# EAGLE schematic oshpark (EAGLE 6.6.0)
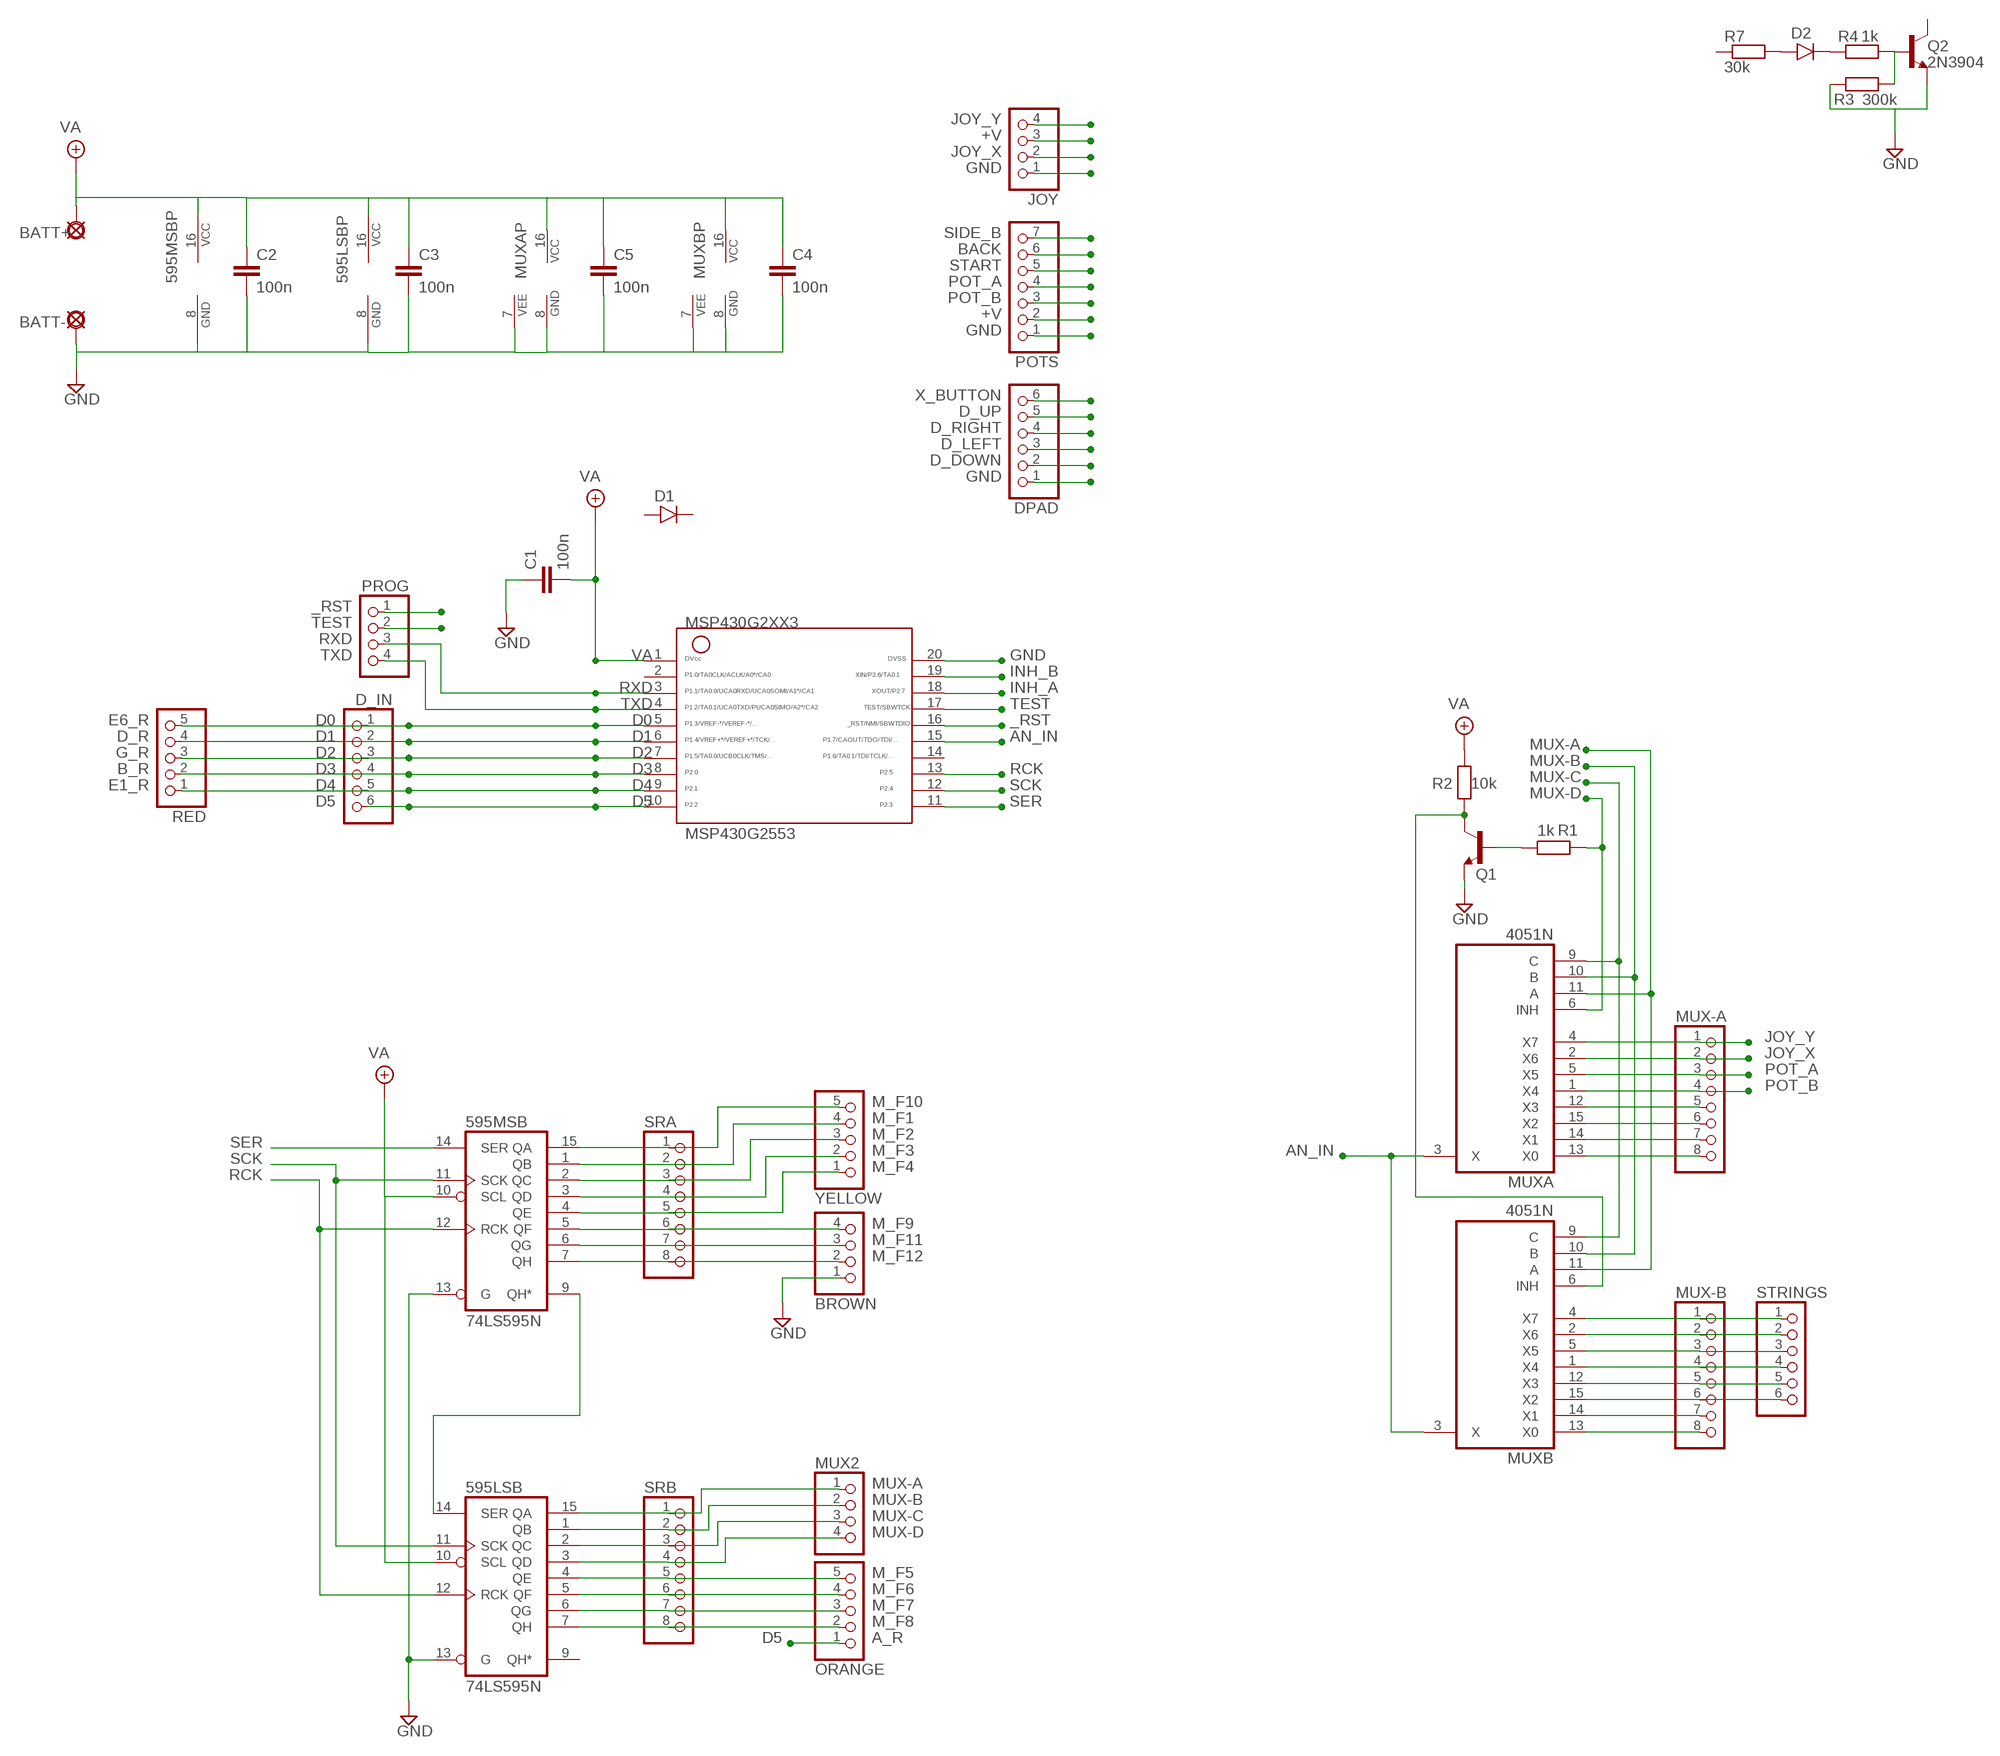
[diagram p0: schematic, sheet 1]

## Parts
595LSB  74LS595N  [DIL16]
595MSB  74LS595N  [DIL16]
BATT+  PADL  [LONG]
BATT-  PADL  [LONG]
BROWN  PINHD-1X4  [1X04]
C1  100n  050X030_050  [050X030_050_3]
C2  100n  050X030_050  [050X030_050_3]
C3  100n  050X030_050  [050X030_050_3]
C4  100n  050X030_050  [050X030_050_3]
C5  100n  050X030_050  [050X030_050_3]
D1  1N400X.4  [DO41-4]
D2  1N4148-2  [DO35-2]
D_IN  PINHD-1X6  [1X06]
DPAD  PINHD-1X6  [1X06]
JOY  PINHD-1X4  [1X04]
MSP430G2553  G2XX3---N20  [N20]
MUX2  PINHD-1X4  [1X04]
MUX-A  PINHD-1X8  [1X08]
MUX-B  PINHD-1X8  [1X08]
MUXA  4051N  [DIL16]
MUXB  4051N  [DIL16]
ORANGE  PINHD-1X5  [1X05]
POTS  PINHD-1X7  [1X07]
PROG  PINHD-1X4  [1X04]
Q1  2N3904  [TO92-]
Q2  2N3904  [TO92-]
R1  1k  6MM-EU  [R0207/3]
R2  10k  6MM-EU  [R0207/3]
R3  300k  6MM-EU1  [R0207/1V]
R4  1k  6MM-EU  [R0207/3]
R7  30k  6MM-EU  [R0207/3]
RED  PINHD-1X5  [1X05]
SRA  PINHD-1X8  [1X08]
SRB  PINHD-1X8  [1X08]
STRINGS  PINHD-1X6  [1X06]
YELLOW  PINHD-1X5  [1X05]

## Nets
+V: 595LSB.16(VCC) BATT+.1(PAD) C2.1 C3.1 C4.1 C5.1 JOY.3 MUXA.16(VCC) MUXB.16(VCC) POTS.2 ; supply symbol labelled VA
_RST: MSP430G2553.16 PROG.1
AN_IN: MSP430G2553.15 MUXA.3(X) MUXB.3(X)
BACK: POTS.6
D0: D_IN.1 MSP430G2553.5 RED.5
D1: D_IN.2 MSP430G2553.6 RED.4
D2: D_IN.3 MSP430G2553.7 RED.3
D3: D_IN.4 MSP430G2553.8 RED.2
D4: D_IN.5 MSP430G2553.9 RED.1
D5: D_IN.6 MSP430G2553.10 ORANGE.1
D_DOWN: DPAD.2
D_LEFT: DPAD.3
D_RIGHT: DPAD.4
D_UP: DPAD.5
GND: 595LSB.8(GND) 595LSB.13(G) 595MSB.8(GND) 595MSB.13(G) BATT-.1(PAD) BROWN.1 C1.1 C2.2 C3.2 C4.2 C5.2 DPAD.1 JOY.1 MSP430G2553.20 MUXA.7(VEE) MUXA.8(GND) MUXB.7(VEE) MUXB.8(GND) POTS.1 Q1.3(E) Q2.3(E) R3.2
INH_A: MSP430G2553.18
INH_B: MSP430G2553.19
JOY_X: JOY.2
JOY_Y: JOY.4 MUX-A.1 MUXA.4(X7)
M_F1: 595MSB.1(QB) SRA.2 YELLOW.4
M_F2: 595MSB.2(QC) SRA.3 YELLOW.3
M_F3: 595MSB.3(QD) SRA.4 YELLOW.2
M_F4: 595MSB.4(QE) SRA.5 YELLOW.1
M_F5: 595LSB.4(QE) ORANGE.5 SRB.5
M_F6: 595LSB.5(QF) ORANGE.4 SRB.6
M_F7: 595LSB.6(QG) ORANGE.3 SRB.7
M_F8: 595LSB.7(QH) ORANGE.2 SRB.8
M_F9: 595MSB.5(QF) BROWN.4 SRA.6
M_F10: 595MSB.15(QA) SRA.1 YELLOW.5
M_F11: 595MSB.6(QG) BROWN.3 SRA.7
M_F12: 595MSB.7(QH) BROWN.2 SRA.8
MUX-A: 595LSB.15(QA) MUX2.1 MUXA.11(A) MUXB.11(A) SRB.1
MUX-B: 595LSB.1(QB) MUX2.2 MUXA.10(B) MUXB.10(B) SRB.2
MUX-C: 595LSB.2(QC) MUX2.3 MUXA.9(C) MUXB.9(C) SRB.3
MUX-D: 595LSB.3(QD) MUX2.4 MUXA.6(INH) R1.1 SRB.4
N$1: 595LSB.14(SER) 595MSB.9(QH*)
N$2: MUX-A.4 MUXA.1(X4)
N$3: Q1.2(B) R1.2
N$4: MUX-A.3 MUXA.5(X5)
N$6: MUX-A.2 MUXA.2(X6)
N$7: Q2.2(B) R3.1 R4.2
N$9: 595MSB.16(VCC)
N$11: MUX-A.5 MUXA.12(X3)
N$12: MUX-A.6 MUXA.15(X2)
N$14: MUX-A.7 MUXA.14(X1)
N$15: MUX-A.8 MUXA.13(X0)
N$16: MUX-B.1 MUXB.4(X7) STRINGS.1
N$17: MUX-B.2 MUXB.2(X6) STRINGS.2
N$18: MUX-B.3 MUXB.5(X5) STRINGS.3
N$19: MUX-B.4 MUXB.1(X4) STRINGS.4
N$20: MUX-B.5 MUXB.12(X3) STRINGS.5
N$22: MUX-B.6 MUXB.15(X2) STRINGS.6
N$23: MUX-B.7 MUXB.14(X1)
N$24: MUX-B.8 MUXB.13(X0)
N$25: D2.C R4.1
N$26: D2.A R7.2
POT_A: POTS.4
POT_B: POTS.3
RCK: 595LSB.12(RCK) 595MSB.12(RCK) MSP430G2553.13
RXD: MSP430G2553.3 PROG.3
SCK: 595LSB.11(SCK) 595MSB.11(SCK) MSP430G2553.12
SER: 595MSB.14(SER) MSP430G2553.11
SIDE_B: POTS.7
START: POTS.5
TEST: MSP430G2553.17 PROG.2
TXD: MSP430G2553.4 PROG.4
VA: 595LSB.10(SCL) 595MSB.10(SCL) C1.2 MSP430G2553.1 R2.2
X_BUTTON: DPAD.6
~MUX-D: MUXB.6(INH) Q1.1(C) R2.1
Unconnected: 595LSB.9(QH*) D1.A D1.C MSP430G2553.2 MSP430G2553.14 Q2.1(C) R7.1

## Notes on the sheet
- E6_R
- D_R
- G_R
- B_R
- E1_R
- A_R

## Library data of the parts
595LSB 595MSB = 74xx-us:74*595: 8-bit SHIFT REGISTER, output latch
BATT+ BATT- = gm-supply:PAD: PAD use this package for pads with any purpose, including input, output, send or return various pad shapes: round, square, octogonal, long, and long offset
BROWN JOY MUX2 PROG = pinhead:PINHD-1X4: PIN HEADER
C1-C5 = gm-caps-ceramic:050X030_050: 120 - 150pF Xicon Ceramic Disc 5mm lead spacing
D1 = gm-diodes:1N400X: Rectifier Diodes often used in power supply to prevent damage from reverse polarization
D2 = gm-diodes:1N4148: Fast Switching Diode DO-35 glass case a.k.a. 1N914
D_IN DPAD STRINGS = pinhead:PINHD-1X6: PIN HEADER
MSP430G2553 = TI_MSP430_v16:G2XX3---N20: MSP430G2XX1 PDIP (N) 20 Pin Package
MUX-A MUX-B SRA SRB = pinhead:PINHD-1X8: PIN HEADER
MUXA MUXB = 40xx:4051: 8-channel ANALOG MULTIPLEXER
ORANGE RED YELLOW = pinhead:PINHD-1X5: PIN HEADER
POTS = pinhead:PINHD-1X7: PIN HEADER
Q1 Q2 = gm-trans:2N3904: NPN Transistor
R1-R4 R7 = gm-resistors:6MM-EU: 6mm Resistors (European schematic symbol) Leads spaced 1-6 holes apart for 0.1" perfboard. Suitable for 1/4 watt resistors.